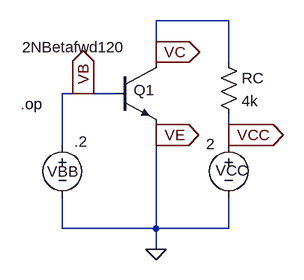
[diagram p0: schematic prob5_20a.asc]
prob5_20a.asc, the LTspice schematic file:
Version 4
SHEET 1 880 680
WIRE 320 64 208 64
WIRE 208 112 208 64
WIRE 208 128 208 112
WIRE 320 128 320 64
WIRE 96 176 64 176
WIRE 144 176 96 176
WIRE 208 240 208 224
WIRE 320 240 320 208
WIRE 64 256 64 176
WIRE 320 256 320 240
WIRE 64 384 64 336
WIRE 208 384 208 240
WIRE 208 384 64 384
WIRE 320 384 320 336
WIRE 320 384 208 384
WIRE 208 416 208 384
FLAG 208 416 0
FLAG 208 112 VC
IOPIN 208 112 Out
FLAG 208 240 VE
IOPIN 208 240 Out
FLAG 96 176 VB
IOPIN 96 176 Out
FLAG 320 240 VCC
IOPIN 320 240 Out
SYMBOL npn 144 128 R0
WINDOW 0 30 43 Left 2
WINDOW 3 -142 -23 Left 2
SYMATTR InstName Q1
SYMATTR Value 2NBetafwd120
SYMBOL voltage 64 240 R0
WINDOW 0 -23 56 Left 2
WINDOW 3 18 10 Left 2
SYMATTR InstName VBB
SYMATTR Value .2
SYMBOL voltage 320 240 R0
WINDOW 0 -20 55 Left 2
WINDOW 3 -35 14 Left 2
SYMATTR InstName VCC
SYMATTR Value 2
SYMBOL res 304 112 R0
SYMATTR InstName RC
SYMATTR Value 4k
TEXT 0 192 Left 2 !.op

The netlist it stands for:
* prob5_20a.asc
Q1 VC VB 0 0 2NBetafwd120
VBB VB 0 .2
VCC VCC 0 2
RC VC VCC 4k
.model NPN NPN
.model PNP PNP
.lib standard.bjt
.op
.backanno
.end

* Results of the author's LTspice run, read from the files saved beside the schematic
* Operating Point:
*   V(vc) = 2 V
*   V(vb) = 200 mV
*   V(vcc) = 2 V
*   Ic(Q1) = 25.03 pA
*   Ib(Q1) = -1.413 pA
*   Ie(Q1) = -23.61 pA
*   I(Rc) = -25.03 pA
*   I(Vbb) = 1.413 pA
*   I(Vcc) = -25.03 pA